# EAGLE design granular_synthesizer_v1 (EAGLE 7.1.0)
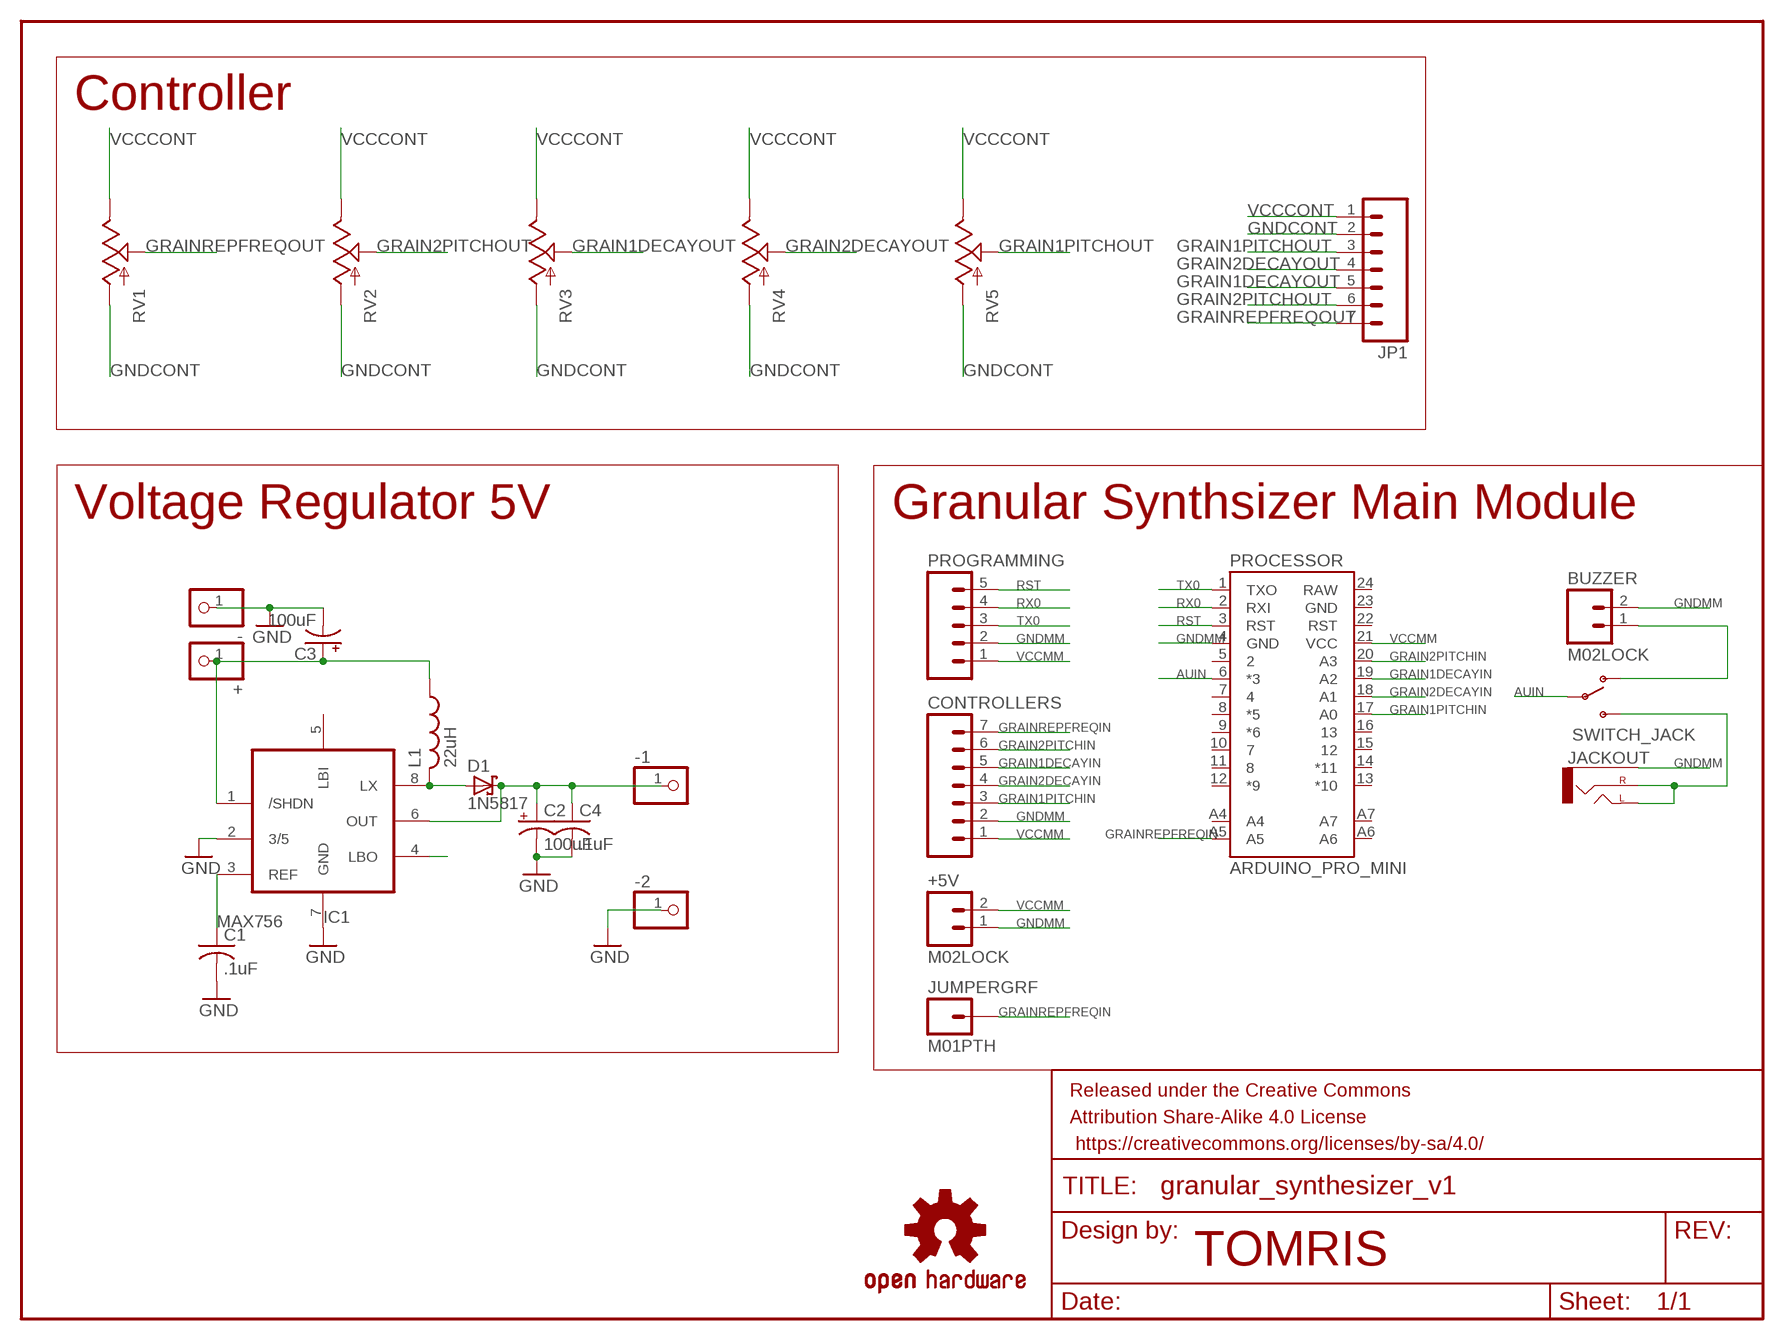
[diagram p0: schematic, sheet 1]

## Parts
+  PINHD-1X1  [1X01]
+5V  M02LOCK  [1X02_LOCK]
-  PINHD-1X1  [1X01]
-1  PINHD-1X1  [1X01]
-2  PINHD-1X1  [1X01]
BUZZER  M02LOCK  [1X02_LOCK]
C1  .1uF  C-US025-024X044  [C025-024X044]
C2  100uF  CPOL-USE2.5-5  [E2,5-5]
C3  100uF  CPOL-USE2.5-5  [E2,5-5]
C4  .1uF  C-US025-024X044  [C025-024X044]
CONTROLLERS  M07  [1X07]
D1  1N5817  SCHOTTKY-DIODEDO41  [DO41-10]
FRAME1  FRAME-LETTER  [CREATIVE_COMMONS]
IC1  MAX756  MAX756CPA  [DIL08]
JACKOUT  AUDIO-JACK2.5MM  [STEREOJACK2.5MM_STEREOJACK2.5MM]
JP1  M07  [1X07]
JUMPERGRF  M01PTH  [1X01]
L1  22uH  L2474/10  [2747]
LOGO1  OSHW-LOGOM  [OSHW-LOGO-M]
LOGO2  OSHW-LOGOM  [OSHW-LOGO-M]
LOGO3  OSHW-LOGOM  [OSHW-LOGO-M]
PROCESSOR  ARDUINO_PRO_MINI  [ARDUINO_PRO_MINI]
PROGRAMMING  M05LOCK  [1X05_LOCK]
RV1  POTMAM  [POT_MAMMOTH]
RV2  POTMAM  [POT_MAMMOTH]
RV3  POTMAM  [POT_MAMMOTH]
RV4  POTMAM  [POT_MAMMOTH]
RV5  POTMAM  [POT_MAMMOTH]
SWITCH_JACK  SWITCH-SPDTPTH  [SWITCH-SPDT]

## Nets
AUIN: PROCESSOR.6(*3) SWITCH_JACK.2(P)
GND: -2.1 -.1 C1.2 C2.- C3.- C4.2 IC1.2(3/5) IC1.7(GND)
GNDCONT: JP1.2 RV1.P$2(A) RV2.P$2(A) RV3.P$2(A) RV4.P$2(A) RV5.P$2(A)
GNDMM: +5V.1 BUZZER.2 CONTROLLERS.2 JACKOUT.RING1(SLEEVE) PROCESSOR.4(GND) PROGRAMMING.2
GRAIN1DECAYIN: CONTROLLERS.5 PROCESSOR.19(A2)
GRAIN1DECAYOUT: JP1.5 RV3.P$1(S)
GRAIN1PITCHIN: CONTROLLERS.3 PROCESSOR.17(A0)
GRAIN1PITCHOUT: JP1.3 RV5.P$1(S)
GRAIN2DECAYIN: CONTROLLERS.4 PROCESSOR.18(A1)
GRAIN2DECAYOUT: JP1.4 RV4.P$1(S)
GRAIN2PITCHIN: CONTROLLERS.6 PROCESSOR.20(A3)
GRAIN2PITCHOUT: JP1.6 RV2.P$1(S)
GRAINREPFREQIN: CONTROLLERS.7 JUMPERGRF.1 PROCESSOR.A5
GRAINREPFREQOUT: JP1.7 RV1.P$1(S)
N$1: JACKOUT.SHIELD(LEFT) JACKOUT.TIP(RIGHT) SWITCH_JACK.3(S)
N$2: C1.1 IC1.3(REF)
N$3: +.1 C3.+ IC1.1(/SHDN) L1.P$1
N$4: BUZZER.1 SWITCH_JACK.1(O)
N$5: D1.A IC1.8(LX) L1.P$2
N$6: IC1.4(LBO)
N$7: -1.1 C2.+ C4.1 D1.C IC1.6(OUT)
RST: PROCESSOR.3(RST) PROGRAMMING.5
RX0: PROCESSOR.2(RXI) PROGRAMMING.4
TX0: PROCESSOR.1(TXO) PROGRAMMING.3
VCCCONT: JP1.1 RV1.P$3(E) RV2.P$3(E) RV3.P$3(E) RV4.P$3(E) RV5.P$3(E)
VCCMM: +5V.2 CONTROLLERS.1 PROCESSOR.21(VCC) PROGRAMMING.1
Unconnected: IC1.5(LBI) PROCESSOR.5 PROCESSOR.7 PROCESSOR.8(*5) PROCESSOR.9(*6) PROCESSOR.10 PROCESSOR.11 PROCESSOR.12(*9) PROCESSOR.13(*10) PROCESSOR.14(*11) PROCESSOR.15 PROCESSOR.16 PROCESSOR.22(RST) PROCESSOR.23(GND) PROCESSOR.24(RAW) PROCESSOR.A4 PROCESSOR.A6 PROCESSOR.A7

## Notes on the sheet
- Controller
- Voltage Regulator 5V | Granular Synthsizer Main Module
- TOMRIS

## Library data of the parts
+ - -1 -2 = pinhead-ez:PINHD-1X1: PIN HEADER
+5V BUZZER = SparkFun-Connectors:M02: Standard 2-pin 0.1" header. Use with - straight break away headers ( PRT-00116) - right angle break away headers (PRT-00553) - swiss pins (PRT-00743) - machine pins (PRT-00117) - female headers (PRT-00115) Molex polarized connector foot print use with: PRT-08233 with associated crimp pins and housings. 2.54_SCREWTERM for use with PRT-10571. 3.5mm Screw Terminal footprints for PRT-08084 5mm Screw Terminal footprints for use with PRT-08432
C1 C4 = rcl-ez:C-US: CAPACITOR, American symbol
C2 C3 = rcl-ez:CPOL-US: POLARIZED CAPACITOR, American symbol
CONTROLLERS JP1 = SparkFun-Connectors:M07: Header 7 Standard 7-pin 0.1" header. Use with straight break away headers (SKU : PRT-00116), right angle break away headers (PRT-00553), swiss pins (PRT-00743), machine pins (PRT-00117), and female headers (PRT-00115). NOTES ON THE VARIANTS LOCK and LOCK_LONGPADS... This footprint was designed to help hold the alignment of a through-hole component (i.e. 7-pin header) while soldering it into place. You may notice that each hole has been shifted either up or down by 0.005 of an inch from it's more standard position (which is usually a perfectly straight line). This slight alteration caused the pins (the squares in the middle) to touch the edges of the holes. Because they are alternating, it causes a "brace" to hold the header in place. 0.005 has proven to be the perfect amount of "off-center" position when using our standard breakaway headers. Although looks a little odd when you look at the bare footprint, once you have a header in there, the alteration is very hard to notice. Also, if you push a header all the way into place, it is covered up entirely on the bottom side. This idea of altering the position of holes to aid alignment will be further integrated into the Sparkfun Library for other footprints. It can help hold any component with 3 or more connection pins.
D1 = usbbuck:SCHOTTKY-DIODE: Schottky Diode
FRAME1 = SparkFun-Aesthetics:FRAME-LETTER: Schematic Frame Standard 8.5x11 US Letter frame
IC1 = usbbuck:MAX756
JACKOUT = SparkFun-Connectors:AUDIO-JACK: 3.5mm Audio Jack Simple 3.5mm common PCB mount audio jack. SKU: PRT-08032
JUMPERGRF = SparkFun-Connectors:M01: Header 1 Standard 1-pin 0.1" header. Use with straight break away headers (SKU : PRT-00116), right angle break away headers (PRT-00553), swiss pins (PRT-00743), machine pins (PRT-00117), and female headers (PRT-00115).
L1 = usbbuck:L
LOGO1-LOGO3 = OSHW-LOGO-M-BOTTOMCOP:OSHW-LOGO: Open Source Hardware Logo This logo indicates the piece of hardware it is found on incorporates a OSHW license and/or adheres to the definition of open source hardware found here: http://freedomdefined.org/OSHW
PROCESSOR = SparkFun-Boards:ARDUINO_PRO_MINI
PROGRAMMING = SparkFun-Connectors:M05: Header 5 Standard 5-pin 0.1" header. Use with straight break away headers (SKU : PRT-00116), right angle break away headers (PRT-00553), swiss pins (PRT-00743), machine pins (PRT-00117), and female headers (PRT-00115). Molex polarized connector foot print use with SKU : PRT-08230 with associated crimp pins and housings.
RV1-RV5 = SparkFun-Electromechanical:POT
SWITCH_JACK = SparkFun-Electromechanical:SWITCH-SPDT: SPDT Switch Simple slide switch, Spark Fun Electronics SKU : COM-00102 DPDT SMT slide switch, AYZ0202, SWCH-08179

## Board
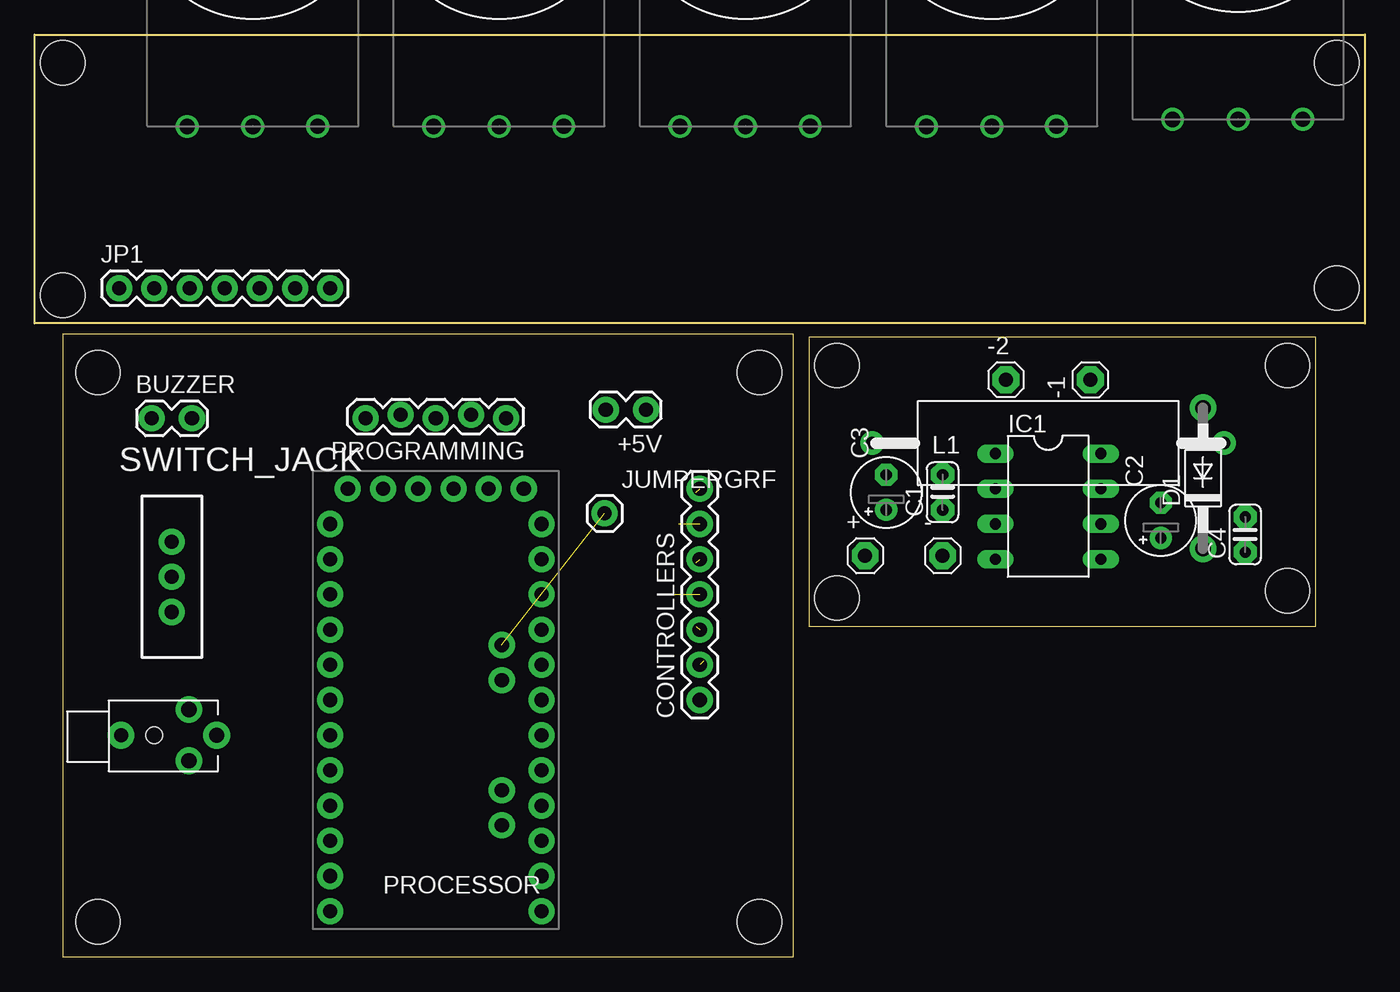
[diagram p1: board, top side]
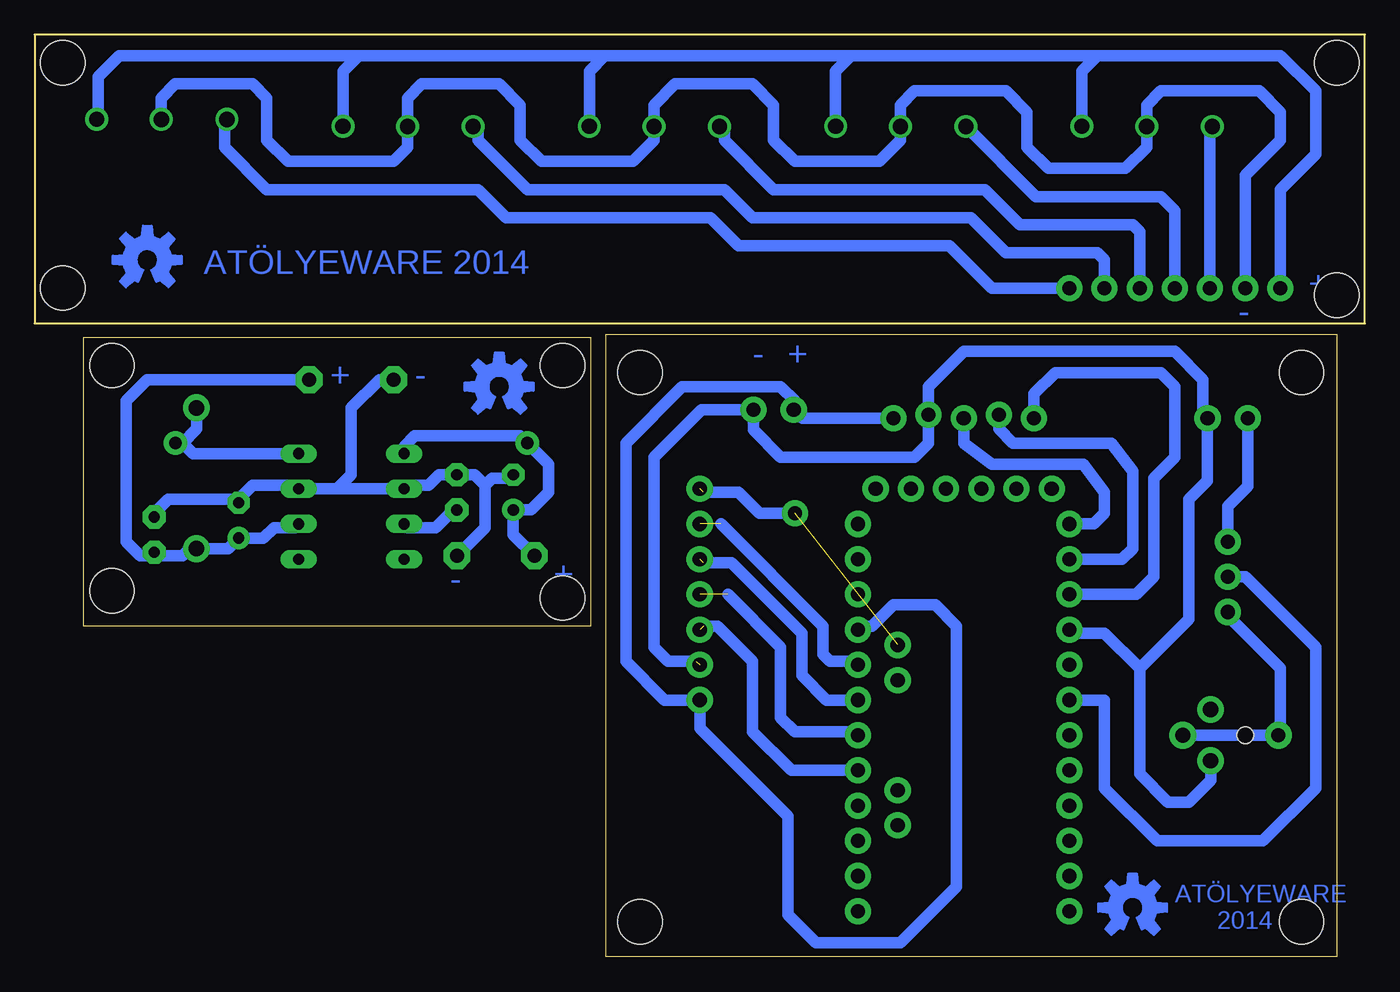
[diagram p2: board, bottom side, seen from below]

Size 96.01 x 66.55 mm. Coordinates in mm from the lower left corner, seen from the top.
Outline: 2.03,0 54.79,0 54.79,44.95 2.03,44.95 2.03,0
Outline: 0,45.72 0,66.55 96.01,66.55 96.01,45.72 0,45.72
Outline: 55.88,44.7 55.88,23.88 92.46,23.88 92.46,44.7 55.88,44.7
Copper layers (1*16): Top 0.035mm / dielectric 1.5mm / Bottom 0.035mm
Design rules "default": minimum track width 10mil, minimum drill 24mil, track to track 8mil, track to pad 8mil, pad to pad 8mil, via to via 8mil, smd to smd 8mil, copper to edge 40mil, drill to drill 8mil, minimum pad ring 10mil, minimum via ring 8mil, stop-mask expansion 4mil, vias tented up to drill 0mil, thermal gap 10mil
Holes 3.2 mm at 52.32,2.54 52.32,42.16 4.57,42.16 4.57,2.54 57.91,42.67 90.42,42.67 57.91,25.91 90.42,26.42 2.03,64.52 2.03,47.75 93.98,64.52 93.98,48.26

### Footprints (pad centres in the part's own frame; a part is rotated, then mirrored left to right if it is on the bottom)
1X01 = drill 1.016 pad 1.93 octagon: 1 0,0
1X02_LOCK = drill 1.016 pad 1.88: 1 -0.178,0; 2 2.718,0
C025-024X044 = drill 0.813 pad 1.676 octagon: 1 -1.27,0; 2 1.27,0
E2,5-5 = drill 0.813 pad 1.6: + -1.27,0 | drill 0.813 pad 1.6 octagon: - 1.27,0
1X07 = drill 1.016 pad 1.88: 1 0,0; 2 2.54,0; 3 5.08,0; 4 7.62,0; 5 10.16,0; 6 12.7,0; 7 15.24,0
DO41-10 = drill 1.118 pad 1.93: A 5.08,0; C -5.08,0
DIL08 = drill 0.813 long: 1 -3.81,-3.81; 2 -1.27,-3.81; 3 1.27,-3.81; 4 3.81,-3.81; 5 3.81,3.81; 6 1.27,3.81; 7 -1.27,3.81; 8 -3.81,3.81
STEREOJACK2.5MM_STEREOJACK2.5MM = drill 1.1 pad 1.93: RING1 2.5,-1.85; RING2 2.5,1.85; TIP 4.5,0 | drill 1 pad 1.93: SHIELD -2.4,0 | hole 1.2: 0,0
1X01' = drill 1.016 pad 1.88: 1 0,0
2747 = drill 0.9 pad 1.676: P$1 -12.7,0; P$2 12.7,0
ARDUINO_PRO_MINI = drill 1.016 pad 1.88: 1 -7.62,12.7; 2 -7.62,10.16; 3 -7.62,7.62; 4 -7.62,5.08; 5 -7.62,2.54; 6 -7.62,0; 7 -7.62,-2.54; 8 -7.62,-5.08; 9 -7.62,-7.62; 10 -7.62,-10.16; 11 -7.62,-12.7; 12 -7.62,-15.24; 13 7.62,-15.24; 14 7.62,-12.7; 15 7.62,-10.16; 16 7.62,-7.62; 17 7.62,-5.08; 18 7.62,-2.54; 19 7.62,0; 20 7.62,2.54; 21 7.62,5.08; 22 7.62,7.62; 23 7.62,10.16; 24 7.62,12.7; A4 4.763,1.429; A5 4.763,3.969; A6 4.763,-9.049; A7 4.763,-6.509; BLK -6.35,15.24; GND -3.81,15.24; GRN 6.35,15.24; RXI 1.27,15.24; TXO 3.81,15.24; VCC -1.27,15.24
1X05_LOCK = drill 1.016 pad 1.88: 1 0,0.127; 2 2.54,-0.127; 3 5.08,0.127; 4 7.62,-0.127; 5 10.16,0.127
POT_MAMMOTH = drill 1.1: P$1 -4.73,-0.02; P$2 0,-0.02; P$3 4.67,-0.01
SWITCH-SPDT = drill 1.016 pad 1.88: 1 0,2.54; 2 0,0; 3 0,-2.54

### Placement (x,y rotation side)
+  59.94,28.96 0 top
+5V  43.94,39.5 180 top
-  65.53,28.96 0 top
-1  76.2,41.66 90 top
-2  70.1,41.66 0 top
BUZZER  8.64,38.86 0 top
C1  65.53,33.53 90 top
C2  81.28,31.5 90 top
C3  61.47,33.53 90 top
C4  87.38,30.48 90 top
CONTROLLERS  48.01,18.54 90 top
D1  84.33,34.54 90 top
FRAME1  43.69,-7.62 0 top  (outside the outline)
IC1  73.15,32.51 270 top
JACKOUT  8.64,16 0 top
JP1  6.1,48.26 0 top
JUMPERGRF  M01PTH  [1X01']  41.15,32 0 top
L1  73.15,37.08 0 top
LOGO1  87.88,50.29 0 top
LOGO2  16.76,3.56 0 top
LOGO3  62.48,41.15 0 top
PROCESSOR  28.96,18.54 0 top
PROGRAMMING  34.04,38.99 180 top
RV1  86.87,60.45 0 top
RV2  69.09,59.94 0 top
RV3  51.31,59.94 0 top
RV4  33.53,59.94 0 top
RV5  15.75,59.94 0 top
SWITCH_JACK  9.91,27.43 0 top

### Tracks (layer width: path | path; a pad name or v marks a point on that pad's centre or on a via)
AUIN
  Bottom 0.813: SWITCH_JACK.2 8.64,27.43 3.56,22.35 3.56,12.19 7.37,8.38 14.99,8.38 18.8,12.19 18.8,18.54 PROCESSOR.6
GND
  Bottom 0.813: C4.2 87.38,32 86.36,33.02 81.53,33.02 C2.- 81.28,33.02 80.26,34.04 77.22,34.04 IC1.7 74.17,33.78 | 74.17,33.78 IC1.2 69.09,34.04 67.56,34.04 66.8,34.8 C1.2 64.26,34.8 63.5,34.04 | -2.1 71.12,41.66 73.15,39.62 73.15,34.8 74.17,33.78 | -.1 63.5,30.99 63.5,34.04 | 63.5,34.04 62.99,34.54 61.72,34.54 C3.-
GNDCONT
  Bottom 0.813: RV1.P$2 86.87,61.98 85.85,62.99 80.26,62.99 79.25,61.98 79.25,58.93 77.72,57.4 70.1,57.4 69.09,58.42 RV2.P$2 69.09,61.98 68.07,62.99 62.48,62.99 60.96,61.47 60.96,58.93 59.44,57.4 52.83,57.4 51.31,58.93 RV3.P$2 51.31,61.47 49.78,62.99 44.2,62.99 42.67,61.47 42.67,58.93 41.15,57.4 35.05,57.4 33.53,58.93 RV4.P$2 33.53,61.47 32.51,62.48 25.91,62.48 24.38,60.96 24.38,58.42 22.86,56.9 17.27,56.9 15.75,58.42 RV5.P$2 15.75,61.47 14.73,62.48 7.62,62.48 6.1,60.96 6.1,58.93 8.64,56.39 JP1.2
GNDMM  (1 unrouted)
  Bottom 0.813: 48.26,21.34 50.29,21.34 51.31,22.35 51.31,36.07 47.88,39.5 +5V.1 44.12,38.02 42.16,36.07 32.51,36.07 31.5,37.08 PROGRAMMING.2 31.5,41.15 28.96,43.69 13.72,43.69 11.68,41.66 11.68,39.19 BUZZER.2 11.35,34.37 12.7,33.02 12.7,24.38 16.26,20.83 | JACKOUT.RING1 11.14,12.74 12.7,11.18 14.22,11.18 16.26,13.21 16.26,20.83 | 16.26,20.83 18.8,23.37 21.08,23.37 PROCESSOR.4
GRAIN1DECAYIN  (1 unrouted)
  Bottom 0.813: PROCESSOR.19 38.86,18.54 40.64,20.32 40.64,23.37 45.72,28.45 47.75,28.45
GRAIN1DECAYOUT
  Bottom 0.813: JP1.5 16.26,52.32 16.76,52.83 24.89,52.83 27.43,55.37 42.67,55.37 46.23,58.93 46.23,59.57 RV3.P$1
GRAIN1PITCHIN  (1 unrouted)
  Bottom 0.813: PROCESSOR.17 41.4,13.46 44.2,16.26 44.2,21.34 46.74,23.88 47.75,23.88
GRAIN1PITCHOUT
  Bottom 0.813: JP1.3 11.18,59.77 RV5.P$1
GRAIN2DECAYIN  (1 unrouted)
  Bottom 0.813: 45.97,26.16 42.16,22.35 42.16,17.27 41.15,16.26 36.83,16.26 PROCESSOR.18
GRAIN2DECAYOUT
  Bottom 0.813: JP1.4 13.72,53.85 14.73,54.86 23.74,54.86 RV4.P$1
GRAIN2PITCHIN  (1 unrouted)
  Bottom 0.813: 46.48,31.24 39.12,23.88 39.12,21.84 38.61,21.34 36.83,21.34 PROCESSOR.20
GRAIN2PITCHOUT
  Bottom 0.813: JP1.6 18.8,50.29 19.3,50.8 25.91,50.8 28.45,53.34 44.2,53.34 46.23,55.37 60.45,55.37 64.01,58.93 64.01,59.57 RV2.P$1
GRAINREPFREQIN  (2 unrouted)
  Bottom 0.813: JUMPERGRF.1 43.69,32 45.21,33.53 47.75,33.53
GRAINREPFREQOUT
  Bottom 0.813: JP1.7 26.92,48.26 29.97,51.31 45.21,51.31 47.24,53.34 61.98,53.34 64.01,55.37 79.25,55.37 82.3,58.42 82.3,60.27 RV1.P$1
N$1
  Bottom 0.813: JACKOUT.TIP JACKOUT.SHIELD 6.1,16.14 6.1,20.83 9.91,24.64 SWITCH_JACK.3
N$2
  Bottom 0.813: C1.1 65.79,32.26 67.06,30.99 69.09,30.99 IC1.3
N$3
  Bottom 0.813: IC1.1 69.34,36.83 68.58,37.59 60.96,37.59 L1.P$1 58.93,35.56 58.93,33.53 60.2,32.26 C3.+ 61.47,30.48 +.1
N$4
  Bottom 0.813: BUZZER.1 8.46,33.96 9.91,32.51 SWITCH_JACK.1
N$5
  Bottom 0.813: L1.P$2 85.34,37.08 | 85.34,37.08 84.33,38.1 D1.A | IC1.8 84.58,36.32 85.34,37.08
N$7
  Bottom 0.813: -1.1 87.88,41.66 89.41,40.13 89.41,29.97 88.39,28.96 87.63,28.96 C4.1 87.12,28.96 85.34,28.96 84.84,29.46 D1.C 82.04,29.46 C2.+ 79.5,30.23 78.74,30.99 77.22,30.99 IC1.6
RST
  Bottom 0.813: PROCESSOR.3 16.51,26.16 15.24,27.43 15.24,34.54 13.72,36.07 13.72,41.15 14.73,42.16 22.35,42.16 23.88,40.64 PROGRAMMING.5
RX0
  Bottom 0.813: PROCESSOR.2 17.53,28.7 16.76,29.46 16.76,35.05 18.29,37.08 25.4,37.08 26.42,38.1 PROGRAMMING.4
TX0
  Bottom 0.813: PROCESSOR.1 19.56,31.24 18.8,32 18.8,33.53 20.32,35.56 26.92,35.56 28.96,37.08 PROGRAMMING.3
VCCCONT
  Bottom 0.813: 19.3,65.02 37.08,65.02 | 37.08,65.02 54.86,65.02 | 54.86,65.02 72.64,65.02 | 72.64,65.02 89.92,65.02 91.44,63.5 91.44,60.54 RV1.P$3 | RV4.P$3 38.2,63.91 37.08,65.02 | RV3.P$3 55.98,63.91 54.86,65.02 | RV2.P$3 73.76,63.91 72.64,65.02 | RV5.P$3 20.42,63.91 19.3,65.02 | JP1.1 6.1,55.37 3.56,57.91 3.56,62.48 6.1,65.02 19.3,65.02
VCCMM
  Bottom 0.813: PROGRAMMING.1 40.59,38.86 +5V.2 41.15,39.57 41.15,40.13 42.16,41.15 49.28,41.15 53.34,37.08 53.34,21.34 50.55,18.54 CONTROLLERS.1 48.01,16.51 41.66,10.16 41.66,3.05 39.62,1.02 33.53,1.02 29.46,5.08 29.46,23.88 30.99,25.4 34.04,25.4 35.56,23.88 36.32,23.88 PROCESSOR.21

### Text on the board
Bottom: ATÖLYEWARE 2014 | + | - | + | - | - | + | + | - | ATÖLYEWARE / 2014
tDocu: TOMRIS